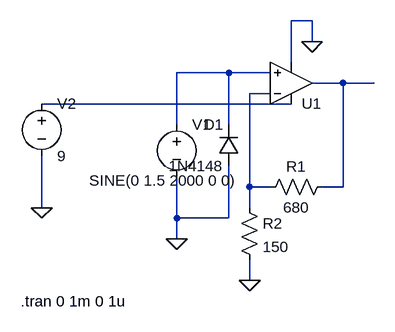
[diagram p0: schematic ampli.asc]
ampli.asc, the LTspice schematic file:
Version 4.1
SHEET 1 880 680
WIRE 256 -528 224 -528
WIRE 256 -496 256 -528
WIRE 224 -464 224 -528
WIRE 128 -448 48 -448
WIRE 192 -448 128 -448
WIRE 304 -432 256 -432
WIRE 352 -432 304 -432
WIRE 192 -416 160 -416
WIRE 224 -400 -160 -400
WIRE 48 -368 48 -448
WIRE 128 -368 128 -448
WIRE 160 -272 160 -416
WIRE 192 -272 160 -272
WIRE 304 -272 304 -432
WIRE 304 -272 272 -272
WIRE -160 -240 -160 -320
WIRE 160 -240 160 -272
WIRE 48 -224 48 -288
WIRE 128 -224 128 -304
WIRE 128 -224 48 -224
WIRE 48 -192 48 -224
WIRE 160 -128 160 -160
FLAG 160 -128 0
FLAG 48 -192 0
FLAG 256 -496 0
FLAG -160 -240 0
SYMBOL OpAmps\\UniversalOpAmp 224 -432 M180
SYMATTR InstName U1
SYMBOL res 288 -288 R90
WINDOW 0 0 56 VBottom 2
WINDOW 3 32 56 VTop 2
SYMATTR InstName R1
SYMATTR Value 680
SYMATTR SpiceLine tol=10 pwr=250m
SYMBOL res 144 -256 R0
SYMATTR InstName R2
SYMATTR Value 150
SYMATTR SpiceLine tol=10 pwr=250m
SYMBOL voltage 48 -384 R0
WINDOW 3 -135 102 Left 2
WINDOW 123 0 0 Left 0
WINDOW 39 0 0 Left 0
SYMATTR Value SINE(0 1.5 2000 0 0)
SYMATTR InstName V1
SYMBOL voltage -160 -416 R0
WINDOW 123 0 0 Left 0
WINDOW 39 0 0 Left 0
SYMATTR InstName V2
SYMATTR Value 9
SYMBOL diode 144 -304 R180
WINDOW 0 24 64 Left 2
WINDOW 3 24 0 Left 2
SYMATTR InstName D1
SYMATTR Value 1N4148
TEXT -192 -96 Left 2 !.tran 0 1m 0 1u

The netlist it stands for:
* ampli.asc
X§U1 N001 N003 N004 0 N002 level1 Avol=1Meg GBW=10Meg Vos=0 En=0 Enk=0 In=0 Ink=0 Rin=500Meg  ; pins In+ In- V+ V- OUT
R1 N002 N003 680 tol=10 pwr=250m
R2 N003 0 150 tol=10 pwr=250m
V1 N001 0 SINE(0 1.5 2000 0 0)
V2 N004 0 9
D1 0 N001 1N4148
.model D D
.lib standard.dio
.tran 0 1m 0 1u
.lib UniversalOpAmp1.lib
.backanno
.end